# Altium schematic sheet smoothieboard-alt-p5.SchDoc: =ProjectTitle
size B; Organization: Altium Limited; Address1: L3, 12a Rodborough Rd; Address2: Frenchs Forest; Address3: NSW; Address4: Australia 2086; DocumentNumber: 6; SheetNumber: 6; SheetTotal: 6
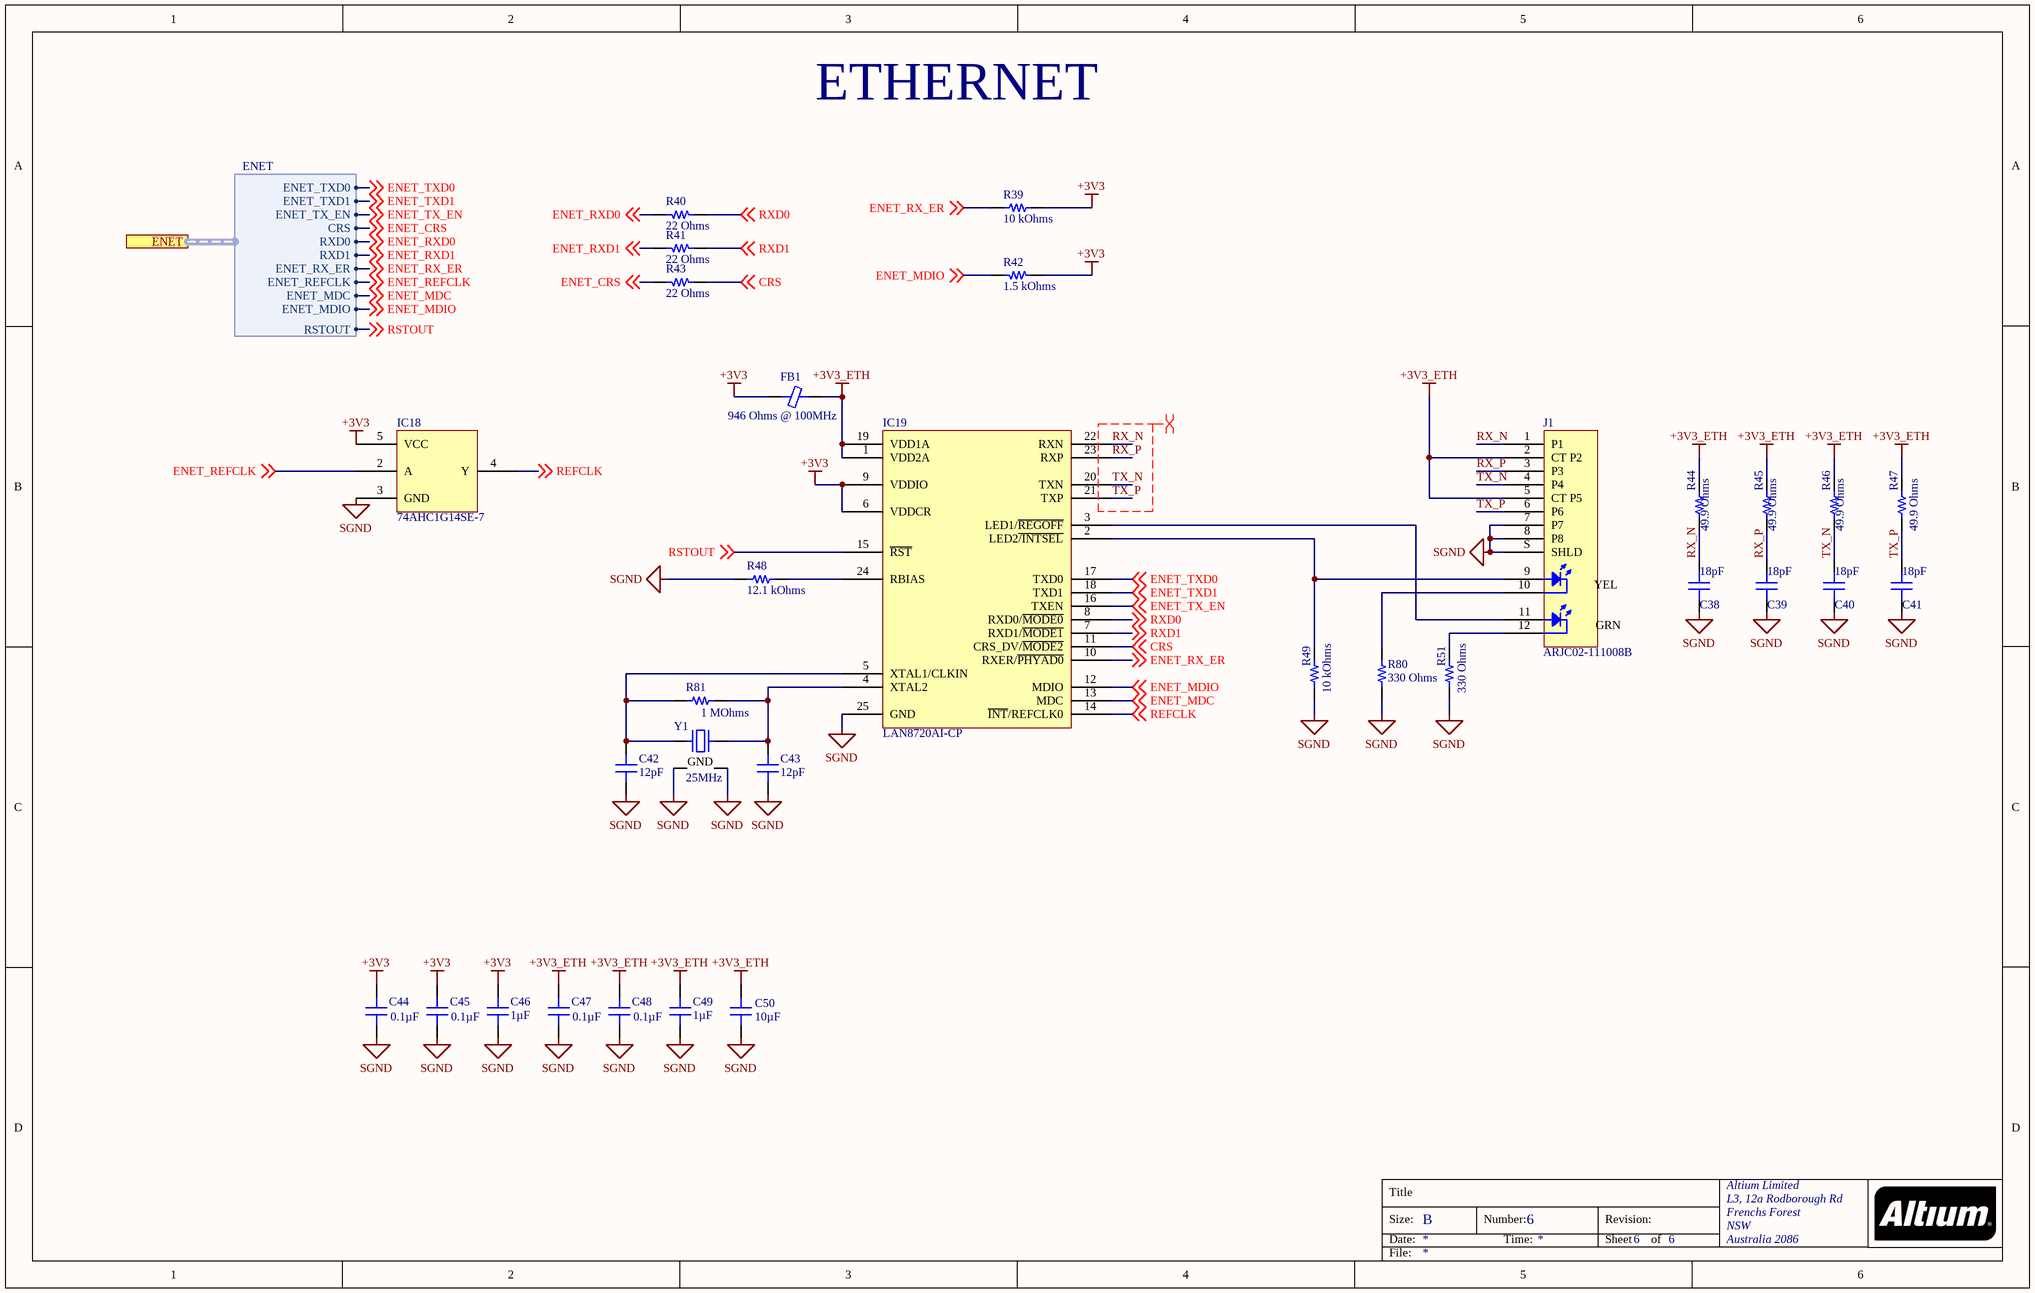
[diagram p0: smoothieboard-alt-p5.SchDoc]

## Parts
C38  18pF  [CAP 0402_1005]
C39  18pF  [CAP 0402_1005]
C40  18pF  [CAP 0402_1005]
C41  18pF  [CAP 0402_1005]
C42  12pF  [CAP 0402_1005]
C43  12pF  [CAP 0402_1005]
C44  0.1µF  [CAP 0402_1005]
C45  0.1µF  [CAP 0402_1005]
C46  1µF  [CAP 0603_1608]
C47  0.1µF  [CAP 0402_1005]
C48  0.1µF  [CAP 0402_1005]
C49  1µF  [CAP 0603_1608]
C50  10µF  [CAP 0603_1608]
FB1  946 Ohms @ 100MHz  [FER 1206_3216]
IC18  74AHC1G14SE-7  [DIODES INC - SOT353]
IC19  LAN8720AI-CP  [SMSC QFN-24 4X4MM]
J1  ARJC02-111008B  [ABRACON ARJC02-111008B]
R39  10 kOhms  [RES 0603_1608]
R40  22 Ohms  [RES 0603_1608]
R41  22 Ohms  [RES 0603_1608]
R42  1.5 kOhms  [RES 0402_1005]
R43  22 Ohms  [RES 0603_1608]
R44  49.9 Ohms  [RES 0402_1005]
R45  49.9 Ohms  [RES 0402_1005]
R46  49.9 Ohms  [RES 0402_1005]
R47  49.9 Ohms  [RES 0402_1005]
R48  12.1 kOhms  [RES 0402_1005]
R49  10 kOhms  [RES 0603_1608]
R51  330 Ohms  [RES 0603_1608]
R80  330 Ohms  [RES 0603_1608]
R81  1 MOhms  [RES 0402_1005]
Y1  25MHz  [KYOCERA CX2016DB]

## Ports
ENET (harness ENET)

## Harnesses
ENET: CRS, RXD0, RXD1, ENET_TXD0, ENET_TXD1, ENET_TX_EN, ENET_RX_ER, ENET_REFCLK, ENET_MDC, ENET_MDIO, RSTOUT

## Nets
+3V3: C44.2 C45.2 C46.2 FB1.1 IC18.5(VCC) IC19.6(VDDCR) IC19.9(VDDIO) R39.2 R42.1
+3V3_ETH: C47.2 C48.2 C49.2 C50.2 FB1.2 IC19.1(VDD2A) IC19.19(VDD1A) J1.2(CT_P2) J1.5(CT_P5) R44.2 R45.2 R46.2 R47.2
SGND: C38.1 C39.1 C40.1 C41.1 C42.2 C43.2 C44.1 C45.1 C46.1 C47.1 C48.1 C49.1 C50.1 IC18.3(GND) IC19.25(GND) J1.7(P7) J1.8(P8) J1.S(SHLD) R48.1 R49.2 R51.2 R80.2 Y1.2(GND) Y1.4(GND)
CRS: IC19.11(CRS_DV/~{MODE2}) R43.1 ; off-sheet CRS
ENET_CRS: R43.2 ; off-sheet ENET_CRS, port ENET.CRS
ENET_MDC: IC19.13(MDC) ; off-sheet ENET_MDC, port ENET.ENET_MDC
ENET_MDIO: IC19.12(MDIO) R42.2 ; off-sheet ENET_MDIO, port ENET.ENET_MDIO
ENET_REFCLK: IC18.2(A) ; off-sheet ENET_REFCLK, port ENET.ENET_REFCLK
ENET_RX_ER: IC19.10(RXER/~{PHYAD0}) R39.1 ; off-sheet ENET_RX_ER, port ENET.ENET_RX_ER
ENET_RXD0: R40.2 ; off-sheet ENET_RXD0, port ENET.RXD0
ENET_RXD1: R41.2 ; off-sheet ENET_RXD1, port ENET.RXD1
ENET_TX_EN: IC19.16(TXEN) ; off-sheet ENET_TX_EN, port ENET.ENET_TX_EN
ENET_TXD0: IC19.17(TXD0) ; off-sheet ENET_TXD0, port ENET.ENET_TXD0
ENET_TXD1: IC19.18(TXD1) ; off-sheet ENET_TXD1, port ENET.ENET_TXD1
REFCLK: IC18.4(Y) IC19.14(~{INT}/REFCLK0) ; off-sheet REFCLK
RSTOUT: IC19.15(~{RST}) ; off-sheet RSTOUT, port ENET.RSTOUT
RX_N: C38.2 IC19.22(RXN) J1.1(P1) R44.1
RX_P: C39.2 IC19.23(RXP) J1.3(P3) R45.1
RXD0: IC19.8(RXD0/~{MODE0}) R40.1 ; off-sheet RXD0
RXD1: IC19.7(RXD1/~{MODE1}) R41.1 ; off-sheet RXD1
TX_N: C40.2 IC19.20(TXN) J1.4(P4) R46.1
TX_P: C41.2 IC19.21(TXP) J1.6(P6) R47.1
NetC42_1: C42.1 IC19.5(XTAL1/CLKIN) R81.2 Y1.1
NetC43_1: C43.1 IC19.4(XTAL2) R81.1 Y1.3
NetIC19_2: IC19.2(LED2~{/INTSEL}) J1.9(P9) R49.1
NetIC19_3: IC19.3(LED1/~{REGOFF}) J1.11(P11)
NetIC19_24: IC19.24(RBIAS) R48.2
NetJ1_10: J1.10(P10) R80.1
NetJ1_12: J1.12(P12) R51.1

## Layout directives
differential pair: RX_N, RX_P, TX_N, TX_P

## Notes on the sheet
- ETHERNET
- Title
- Size:
- Date:
- B
- Number:
- Time:
- Revision:
- Sheet
- of
- File:
- (in symbol ARJC02-111008B) YEL; GRN

## Library data of the parts
C38-C41 = VJ0402A180JXJPW1BC: CAP CER 18PF 16V C0G/NP0 0402; Manufacturer: Vishay Vitramon; Temperature Coefficient: C0G, NP0; Tolerance: ±5%; Part Number: VJ0402A180JXJPW1BC; Value: 18pF; Applications: General Purpose; Capacitance: 18pF; ComponentLink1Description: Datasheet; ComponentLink1URL: https://www.vishay.com/docs/28548/vjw1bcbascomseries.pdf; ComponentLink2Description: DigiKey Link; ComponentLink2URL: http://digikey.com/product-detail/en/vishay-vitramon/VJ0402A180JXJPW1BC/720-1639-1-ND/8324059; Device Package: 0402 (1005 Metric); LastUpdated: 9/2/2020 01:02:23; Lifecycle Status: Active; Minimum Order: 1; Mounting Type: Surface Mount, MLCC; Operating Temperature: -55°C ~ 125°C; Package / Case: 0402 (1005 Metric); Packaging: TapeAndReel; PartId: 2399; Part Status: Active; Price: 0.01; Series: VJ; Size / Dimension: 0.039" L x 0.020" W (1.00mm x 0.50mm); Supplier 1: DigiKey; Supplier Part Number 1: 720-1639-1-ND; Thickness (Max): 0.022" (0.55mm); Voltage - Rated: 16V
C42 C43 = C0402C120J8GAC7867: CAP CER 12PF 10V NP0 0402; Manufacturer: KEMET; Temperature Coefficient: C0G, NP0; Tolerance: ±5%; Part Number: C0402C120J8GAC7867; Value: 12pF; Applications: General Purpose; Capacitance: 12pF; ComponentLink1Description: Datasheet; ComponentLink1URL: https://api.kemet.com/component-edge/download/datasheet/C0402C120J8GACTU.pdf; ComponentLink2Description: DigiKey Link; ComponentLink2URL: http://digikey.com/product-detail/en/kemet/C0402C120J8GAC7867/399-14417-1-ND/7103709; Device Package: 0402 (1005 Metric); Features: Low ESL; LastUpdated: 9/2/2020 01:02:11; Lifecycle Status: Active; Minimum Order: 1; Mounting Type: Surface Mount, MLCC; Operating Temperature: -55°C ~ 125°C; Package / Case: 0402 (1005 Metric); Packaging: TapeAndReel; PartId: 7556; Part Status: Active; Price: 0.07; Series: SMD Comm C0G; Size / Dimension: 0.039" L x 0.020" W (1.00mm x 0.50mm); Supplier 1: DigiKey; Supplier Part Number 1: 399-14417-1-ND; Thickness (Max): 0.022" (0.55mm); Voltage - Rated: 10V
C44 C45 C47 C48 = CC0402MRX5R5BB104: CAP CER 0.1UF 6.3V X5R 0402; Manufacturer: Yageo; Tolerance: ±20%; Part Number: CC0402MRX5R5BB104; Value: 0.1µF; Applications: General Purpose; Capacitance: 0.1µF; ComponentLink1Description: Datasheet; ComponentLink1URL: https://www.yageo.com/upload/media/product/productsearch/datasheet/mlcc/UPY-GPHC_X5R_4V-to-50V_25.pdf; ComponentLink2Description: DigiKey Link; ComponentLink2URL: http://digikey.com/product-detail/en/yageo/CC0402MRX5R5BB104/311-3818-1-ND/8024907; Device Package: 0402 (1005 Metric); LastUpdated: 9/2/2020 01:02:24; Lifecycle Status: Active; Minimum Order: 1; Mounting Type: Surface Mount, MLCC; Operating Temperature: -55°C ~ 85°C; Package / Case: 0402 (1005 Metric); Packaging: CutTape; PartId: 1960; Part Status: Active; Price: 0.10; Series: CC; Size / Dimension: 0.039" L x 0.020" W (1.00mm x 0.50mm); Supplier 1: DigiKey; Supplier Part Number 1: 311-3818-1-ND; Temperature Coefficient: X5R; Thickness (Max): 0.022" (0.55mm); Voltage - Rated: 6.3V
C46 C49 = UMK107ABJ105MAHT: CAP CER 1UF 50V X5R 0603; Manufacturer: Taiyo Yuden; Tolerance: ±20%; Part Number: UMK107ABJ105MAHT; Value: 1µF; Applications: Automotive, SMPS Filtering; Capacitance: 1µF; ComponentLink1Description: Datasheet; ComponentLink1URL: https://www.yuden.co.jp/productdata/catalog/mlcc_all_hq_e.pdf; ComponentLink2Description: DigiKey Link; ComponentLink2URL: http://digikey.com/product-detail/en/taiyo-yuden/UMK107ABJ105MAHT/587-4958-1-ND/6563801; Device Package: 0603 (1608 Metric); LastUpdated: 9/2/2020 01:03:34; Lifecycle Status: Active; Minimum Order: 1; Mounting Type: Surface Mount, MLCC; Operating Temperature: -55°C ~ 85°C; Package / Case: 0603 (1608 Metric); Packaging: TapeAndReel; PartId: 3194; Part Status: Active; Price: 0.04; Ratings: AEC-Q200; Series: M; Size / Dimension: 0.063" L x 0.031" W (1.60mm x 0.80mm); Supplier 1: DigiKey; Supplier Part Number 1: 587-4958-1-ND; Temperature Coefficient: X5R; Thickness (Max): 0.037" (0.95mm); Voltage - Rated: 50V
C50 = GRM188R60J106KE47D: CAP CER 10UF 6.3V X5R 0603; Manufacturer: Murata Electronics; Tolerance: ±10%; Part Number: GRM188R60J106KE47D; Value: 10µF; Applications: General Purpose; Capacitance: 10µF; ComponentLink1Description: Datasheet; ComponentLink1URL: https://search.murata.co.jp/Ceramy/image/img/A01X/G101/ENG/GRM188R60J106KE47-02.pdf; ComponentLink2Description: DigiKey Link; ComponentLink2URL: http://digikey.com/product-detail/en/murata-electronics/GRM188R60J106KE47D/490-12538-1-ND/5797528; Device Package: 0603 (1608 Metric); LastUpdated: 9/2/2020 01:03:11; Lifecycle Status: Active; Minimum Order: 1; Mounting Type: Surface Mount, MLCC; Operating Temperature: -55°C ~ 85°C; Package / Case: 0603 (1608 Metric); Packaging: TapeAndReel; PartId: 14982; Part Status: Active; Price: 0.03; Series: GRM; Size / Dimension: 0.063" L x 0.031" W (1.60mm x 0.80mm); Supplier 1: DigiKey; Supplier Part Number 1: 490-12538-1-ND; Temperature Coefficient: X5R; Thickness (Max): 0.035" (0.90mm); Voltage - Rated: 6.3V
FB1 = LF1206E152R-10: FERRITE BEAD 946 OHM 1206 1LN; Manufacturer: Laird-Signal Integrity Products; Current Rating (Max): 500mA; DC Resistance (DCR) (Max): 300mOhm; Filter Type: Power, Signal Line; Number of Lines: 1; Part Number: LF1206E152R-10; ComponentLink1Description: Datasheet; ComponentLink1URL: https://assets.lairdtech.com/home/brandworld/files/Catalog_EMI%20FILTERING%20RF%200717.pdf; ComponentLink2Description: DigiKey Link; ComponentLink2URL: http://digikey.com/product-detail/en/laird-signal-integrity-products/LF1206E152R-10/240-2566-1-ND/1236446; Device Package: 1206 (3216 Metric); Height (Max): 0.051" (1.30mm); Impedance @ Frequency: 946 Ohms @ 100MHz; LastUpdated: 9/2/2020 01:18:24; Lifecycle Status: Active; Minimum Order: 1; Mounting Type: Surface Mount; Operating Temperature: -40°C ~ 125°C; Package / Case: 1206 (3216 Metric); Packaging: TapeAndReel; PartId: 1683; Part Status: Active; Price: 0.05; Series: LF; Size / Dimension: 0.126" L x 0.063" W (3.20mm x 1.60mm); Supplier 1: DigiKey; Supplier Part Number 1: 240-2566-1-ND; Value: 946 Ohms @ 100MHz
IC18 = 74AHC1G14SE-7: IC INVERTER SCHMITT 1CH SOT353; Manufacturer: Diodes Incorporated; Current - Output High, Low: 8mA, 8mA; Current - Quiescent (Max): 1µA; Logic Level - High: 2.2V ~ 3.85V; Logic Level - Low: 0.9V ~ 1.65V; Max Propagation Delay @ V, Max CL: 10.6ns @ 5V, 50pF; Number of Circuits: 1; Voltage - Supply: 2V ~ 5.5V; Part Number: 74AHC1G14SE-7; ComponentLink1Description: Datasheet; ComponentLink1URL: https://www.diodes.com/assets/Datasheets/74AHC1G14.pdf; ComponentLink2Description: DigiKey Link; ComponentLink2URL: http://digikey.com/product-detail/en/diodes-incorporated/74AHC1G14SE-7/74AHC1G14SE-7DICT-ND/2639309; Device Package: 5-TSSOP, SC-70-5, SOT-353; Features: Schmitt Trigger; LastUpdated: 3/4/2020 22:03:22; Lifecycle Status: Active; Logic Type: Inverter; Minimum Order: 1; Mounting Type: Surface Mount; Number of Inputs: 1; Operating Temperature: -40°C ~ 125°C; Package / Case: 5-TSSOP, SC-70-5, SOT-353; Packaging: TapeAndReel; PartId: 8; Part Status: Active; Price: 0.05; Series: 74AHC; Supplier 1: DigiKey; Supplier Part Number 1: 74AHC1G14SE-7DICT-ND; Supplier Device Package: SOT-353
IC19 = LAN8720AI-CP: IC TRANSCEIVER FULL 2/2 24QFN; Manufacturer: Microchip Technology; Protocol: RMII; Voltage - Supply: 1.6V ~ 3.6V; Part Number: LAN8720AI-CP; ComponentLink1Description: Datasheet; ComponentLink1URL: http://www.microchip.com/mymicrochip/filehandler.aspx?ddocname=en586588; ComponentLink2Description: DigiKey Link; ComponentLink2URL: http://digikey.com/product-detail/en/microchip-technology/LAN8720AI-CP/638-1084-ND/2166036; Duplex: Full; LastUpdated: 9/2/2020 01:27:36; Lifecycle Status: Active; Minimum Order: 1; Mounting Type: Surface Mount; Number of Drivers/Receivers: 2/2; Operating Temperature: -40°C ~ 85°C; Package / Case: 24-VFQFN Exposed Pad; Packaging: Tray; Part Status: Active; Price: 1.45; Series: -; Supplier 1: DigiKey; Supplier Part Number 1: 638-1084-ND; Supplier Device Package: 24-QFN-EP (4x4); Type: Transceiver
J1 = ARJC02-111008B: CONN MAGJACK 1PORT 100 BASE-TX; Manufacturer: Abracon LLC; Connector Type: RJ45; LED Color: Yellow - Green; Number of Cores per Jack: 4; Number of Ports: 1; Shielding: Shielded, EMI Finger; Tab Direction: Down; Part Number: ARJC02-111008B; Applications: 10/100 Base-TX, AutoMDIX; ComponentLink1Description: Datasheet; ComponentLink1URL: https://abracon.com/Magnetics/lan/ARJC02-111008B.PDF; ComponentLink2Description: DigiKey Link; ComponentLink2URL: http://digikey.com/product-detail/en/abracon-llc/ARJC02-111008B/535-12605-ND/4696789; Features: Board Guide; Height Above Board: 0.534" (13.55mm); LastUpdated: 1/15/2020 03:56:28; Lifecycle Status: Active; Minimum Order: 1; Mounting Type: Through Hole; Number of Rows: 1; Operating Temperature: 0°C ~ 70°C; Orientation: 90° Angle (Right); Packaging: Tray; Part Status: Active; Price: 7.80; Series: ARJC02; Supplier 1: DigiKey; Supplier Part Number 1: 535-12605-ND; Termination: Solder
R39 R49 = RCS060310K0JNEA: RES SMD 10K OHM 5% 1/4W 0603; Manufacturer: Vishay Dale; Power (Watts): 0.25W, 1/4W; Temperature Coefficient: ±200ppm/°C; Part Number: RCS060310K0JNEA; Value: 10 kOhms; ComponentLink1Description: Datasheet; ComponentLink1URL: http://www.vishay.com/docs/20065/rcse3.pdf; ComponentLink2Description: DigiKey Link; ComponentLink2URL: http://digikey.com/product-detail/en/vishay-dale/RCS060310K0JNEA/541-2817-1-ND/5867110; Composition: Thick Film; Device Package: 0603 (1608 Metric); Features: Automotive AEC-Q200, Pulse Withstanding; Height - Seated (Max): 0.020" (0.50mm); LastUpdated: 9/2/2020 01:10:24; Lifecycle Status: Active; Minimum Order: 1; Number of Terminations: 2; Operating Temperature: -55°C ~ 155°C; Package / Case: 0603 (1608 Metric); Packaging: TapeAndReel; PartId: 5383; Part Status: Active; Price: 0.02; Ratings: AEC-Q200; Resistance: 10 kOhms; Series: RCS e3; Size / Dimension: 0.061" L x 0.033" W (1.55mm x 0.85mm); Supplier 1: DigiKey; Supplier Part Number 1: 541-2817-1-ND; Supplier Device Package: 0603; Tolerance: ±5%
R40 R41 R43 = ERJ-3EKF22R0V: RES SMD 22 OHM 1% 1/10W 0603; Manufacturer: Panasonic Electronic Components; Power (Watts): 0.1W, 1/10W; Temperature Coefficient: ±100ppm/°C; Part Number: ERJ-3EKF22R0V; Value: 22 Ohms; ComponentLink1Description: Datasheet; ComponentLink1URL: https://industrial.panasonic.com/cdbs/www-data/pdf/RDA0000/AOA0000C304.pdf; ComponentLink2Description: DigiKey Link; ComponentLink2URL: http://digikey.com/product-detail/en/panasonic-electronic-components/ERJ-3EKF22R0V/P22.0HCT-ND/1746745; Composition: Thick Film; Device Package: 0603 (1608 Metric); Features: Automotive AEC-Q200; Height - Seated (Max): 0.022" (0.55mm); LastUpdated: 9/2/2020 01:10:23; Lifecycle Status: Active; Minimum Order: 1; Number of Terminations: 2; Operating Temperature: -55°C ~ 155°C; Package / Case: 0603 (1608 Metric); Packaging: TapeAndReel; PartId: 5655; Part Status: Active; Price: 0.01; Ratings: AEC-Q200; Resistance: 22 Ohms; Series: ERJ; Size / Dimension: 0.063" L x 0.031" W (1.60mm x 0.80mm); Supplier 1: DigiKey; Supplier Part Number 1: P22.0HCT-ND; Supplier Device Package: 0603; Tolerance: ±1%
R42 = RCS04021K50FKED: RES SMD 1.5K OHM 1% 1/5W 0402; Manufacturer: Vishay Dale; Power (Watts): 0.2W, 1/5W; Temperature Coefficient: ±100ppm/°C; Part Number: RCS04021K50FKED; Value: 1.5 kOhms; ComponentLink1Description: Datasheet; ComponentLink1URL: http://www.vishay.com/docs/20065/rcse3.pdf; ComponentLink2Description: DigiKey Link; ComponentLink2URL: http://digikey.com/product-detail/en/vishay-dale/RCS04021K50FKED/541-2889-1-ND/5867182; Composition: Thick Film; Device Package: 0402 (1005 Metric); Features: Automotive AEC-Q200, Pulse Withstanding; Height - Seated (Max): 0.016" (0.40mm); LastUpdated: 9/2/2020 01:07:26; Lifecycle Status: Active; Minimum Order: 1; Number of Terminations: 2; Operating Temperature: -55°C ~ 155°C; Package / Case: 0402 (1005 Metric); Packaging: TapeAndReel; PartId: 21427; Part Status: Active; Price: 0.01; Ratings: AEC-Q200; Resistance: 1.5 kOhms; Series: RCS e3; Size / Dimension: 0.039" L x 0.020" W (1.00mm x 0.50mm); Supplier 1: DigiKey; Supplier Part Number 1: 541-2889-1-ND; Supplier Device Package: 0402; Tolerance: ±1%
R44-R47 = RR0510R-49R9-D: RES SMD 49.9 OHM 0.5% 1/16W 0402; Manufacturer: Susumu; Power (Watts): 0.063W, 1/16W; Temperature Coefficient: ±100ppm/°C; Part Number: RR0510R-49R9-D; Value: 49.9 Ohms; ComponentLink1Description: Datasheet; ComponentLink1URL: http://www.susumu.co.jp/common/pdf/n_catalog_partition05_en.pdf; ComponentLink2Description: DigiKey Link; ComponentLink2URL: http://digikey.com/product-detail/en/susumu/RR0510R-49R9-D/RR05R49.9DCT-ND/567334; Composition: Thin Film; Device Package: 0402 (1005 Metric); Height - Seated (Max): 0.016" (0.40mm); LastUpdated: 9/2/2020 01:08:09; Lifecycle Status: Active; Minimum Order: 1; Number of Terminations: 2; Operating Temperature: -55°C ~ 125°C; Package / Case: 0402 (1005 Metric); Packaging: TapeAndReel; PartId: 3128; Part Status: Active; Price: 0.01; Resistance: 49.9 Ohms; Series: RR; Size / Dimension: 0.039" L x 0.020" W (1.00mm x 0.50mm); Supplier 1: DigiKey; Supplier Part Number 1: RR05R49.9DCT-ND; Tolerance: ±0.5%
R48 = CRCW040212K1FKTD: RES SMD 12.1K OHM 1% 1/16W 0402; Manufacturer: Vishay Dale; Power (Watts): 0.063W, 1/16W; Temperature Coefficient: ±100ppm/°C; Part Number: CRCW040212K1FKTD; Value: 12.1 kOhms; ComponentLink1Description: Datasheet; ComponentLink1URL: http://www.vishay.com/docs/20008/dcrcw.pdf; ComponentLink2Description: DigiKey Link; ComponentLink2URL: http://digikey.com/product-detail/en/vishay-dale/CRCW040212K1FKTD/541-CRCW040212K1FKTDCT-ND/11500769; Composition: Thick Film; Device Package: 0402 (1005 Metric); Features: Automotive AEC-Q200; LastUpdated: 9/2/2020 01:07:21; Lifecycle Status: Active; Minimum Order: 1; Number of Terminations: 2; Operating Temperature: -55°C ~ 155°C; Package / Case: 0402 (1005 Metric); Packaging: TapeAndReel; PartId: 56740; Price: 0.01; Ratings: AEC-Q200; Resistance: 12.1 kOhms; Series: CRCW; Supplier 1: DigiKey; Supplier Part Number 1: 541-CRCW040212K1FKTDCT-ND; Supplier Device Package: 0402; Tolerance: ±1%
R51 R80 = ERJ-3GEYJ331V: RES SMD 330 OHM 5% 1/10W 0603; Manufacturer: Panasonic Electronic Components; Power (Watts): 0.1W, 1/10W; Temperature Coefficient: ±200ppm/°C; Part Number: ERJ-3GEYJ331V; Value: 330 Ohms; ComponentLink1Description: Datasheet; ComponentLink1URL: http://industrial.panasonic.com/www-cgi/jvcr13pz.cgi?E+PZ+3+AOA0001+ERJ3GEYJ331V+7+WW; ComponentLink2Description: DigiKey Link; ComponentLink2URL: http://digikey.com/product-detail/en/panasonic-electronic-components/ERJ-3GEYJ331V/P330GCT-ND/134778; Composition: Thick Film; Device Package: 0603 (1608 Metric); Features: Automotive AEC-Q200; Height - Seated (Max): 0.022" (0.55mm); LastUpdated: 9/2/2020 01:10:18; Lifecycle Status: Active; Minimum Order: 1; Number of Terminations: 2; Operating Temperature: -55°C ~ 155°C; Package / Case: 0603 (1608 Metric); Packaging: TapeAndReel; PartId: 8114; Part Status: Active; Price: 0.01; Ratings: AEC-Q200; Resistance: 330 Ohms; Series: ERJ; Size / Dimension: 0.063" L x 0.031" W (1.60mm x 0.80mm); Supplier 1: DigiKey; Supplier Part Number 1: P330GCT-ND; Supplier Device Package: 0603; Tolerance: ±5%
R81 = RCS04021M00FKED: RES SMD 1M OHM 1% 1/5W 0402; Manufacturer: Vishay Dale; Power (Watts): 0.2W, 1/5W; Temperature Coefficient: ±100ppm/°C; Part Number: RCS04021M00FKED; Value: 1 MOhms; ComponentLink1Description: Datasheet; ComponentLink1URL: http://www.vishay.com/docs/20065/rcse3.pdf; ComponentLink2Description: DigiKey Link; ComponentLink2URL: http://digikey.com/product-detail/en/vishay-dale/RCS04021M00FKED/541-2902-1-ND/5867195; Composition: Thick Film; Device Package: 0402 (1005 Metric); Features: Automotive AEC-Q200, Pulse Withstanding; Height - Seated (Max): 0.016" (0.40mm); LastUpdated: 9/2/2020 01:07:29; Lifecycle Status: Active; Minimum Order: 1; Number of Terminations: 2; Operating Temperature: -55°C ~ 155°C; Package / Case: 0402 (1005 Metric); Packaging: TapeAndReel; PartId: 20245; Part Status: Active; Price: 0.01; Ratings: AEC-Q200; Resistance: 1 MOhms; Series: RCS e3; Size / Dimension: 0.039" L x 0.020" W (1.00mm x 0.50mm); Supplier 1: DigiKey; Supplier Part Number 1: 541-2902-1-ND; Supplier Device Package: 0402; Tolerance: ±1%
Y1 = CX2016DB25000H0FLJC1: CRYSTAL 25.0000MHZ 12PF SMD; Manufacturer: Kyocera International Inc. Electronic Components; ESR (Equivalent Series Resistance): 150 Ohms; Frequency Stability: ±15ppm; Frequency Tolerance: ±10ppm; Operating Mode: Fundamental; Part Number: CX2016DB25000H0FLJC1; ComponentLink1Description: Datasheet; ComponentLink1URL: //media.digikey.com/pdf/Data%20Sheets/AVX%20PDFs/CX2016DB_USY1M-H1-16426-00_Spec.pdf; ComponentLink2Description: DigiKey Link; ComponentLink2URL: http://digikey.com/product-detail/en/kyocera-international-inc-electronic-components/CX2016DB25000H0FLJC1/1253-1709-1-ND/6123336; Frequency: 25MHz; Height - Seated (Max): 0.018" (0.45mm); LastUpdated: 9/2/2020 01:21:56; Lifecycle Status: Active; Load Capacitance: 12pF; Minimum Order: 1; Mounting Type: Surface Mount; Operating Temperature: -30°C ~ 85°C; Package / Case: 4-SMD, No Lead; Packaging: TapeAndReel; PartId: 458; Part Status: Active; Price: 0.36; Series: CX2016DB, Kyocera; Size / Dimension: 0.079" L x 0.063" W (2.00mm x 1.60mm); Supplier 1: DigiKey; Supplier Part Number 1: 1253-1709-1-ND; Type: MHz Crystal; Value: 25MHz